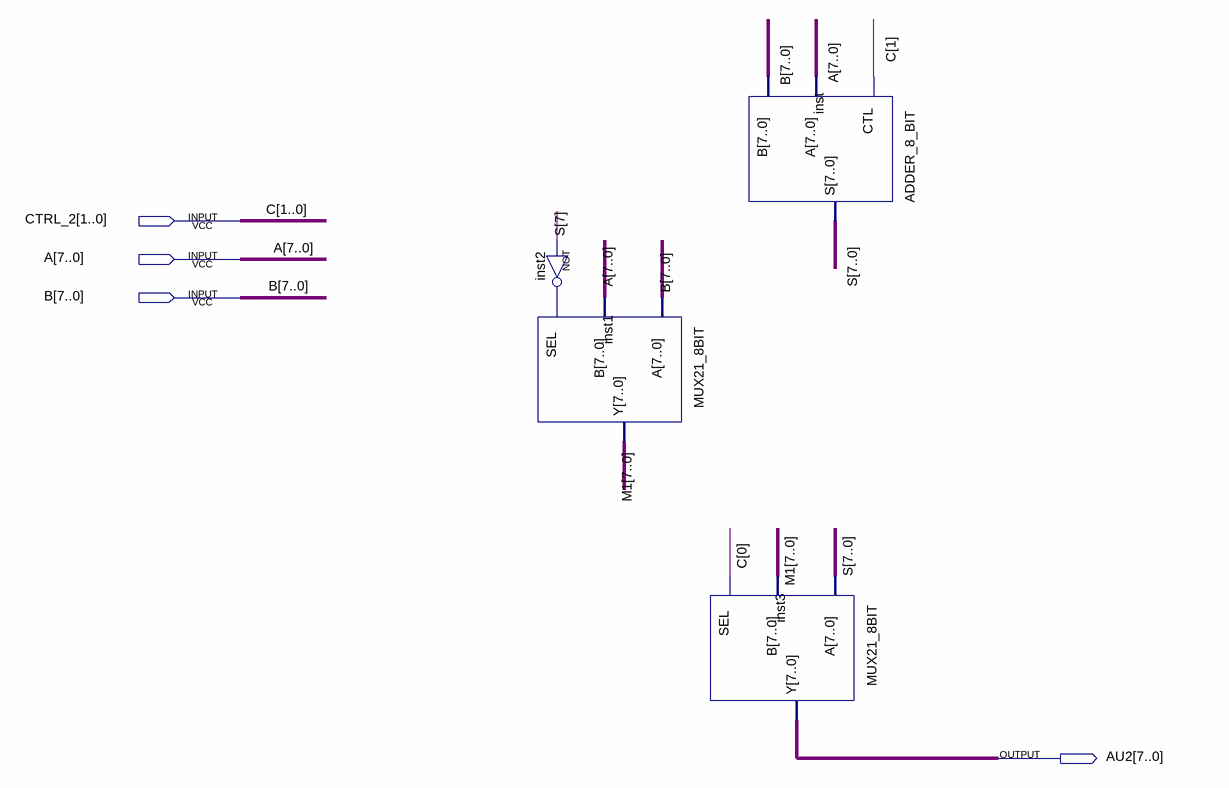
[diagram p0: schematic sheet]
// Quartus schematic AU2.bdf as structural Verilog: 4 symbols, 4 pins
module AU2 (
  input  [1:0] CTRL_2,
  input  [7:0] A,
  input  [7:0] B,
  output [7:0] AU2
);

  wire inst2_out;
  wire [7:0] M1, S;

  not inst2 (inst2_out, S[7]);
  MUX21_8BIT inst1 (.A(B), .B(A), .SEL(inst2_out), .Y(M1));
  MUX21_8BIT inst3 (.A(S), .B(M1), .SEL(CTRL_2[0]), .Y(AU2));
  ADDER_8_BIT inst (.CTL(CTRL_2[1]), .A(A), .B(B), .S(S));

  // Other names for the same wires on the sheet: C[1:0] = CTRL_2
endmodule
